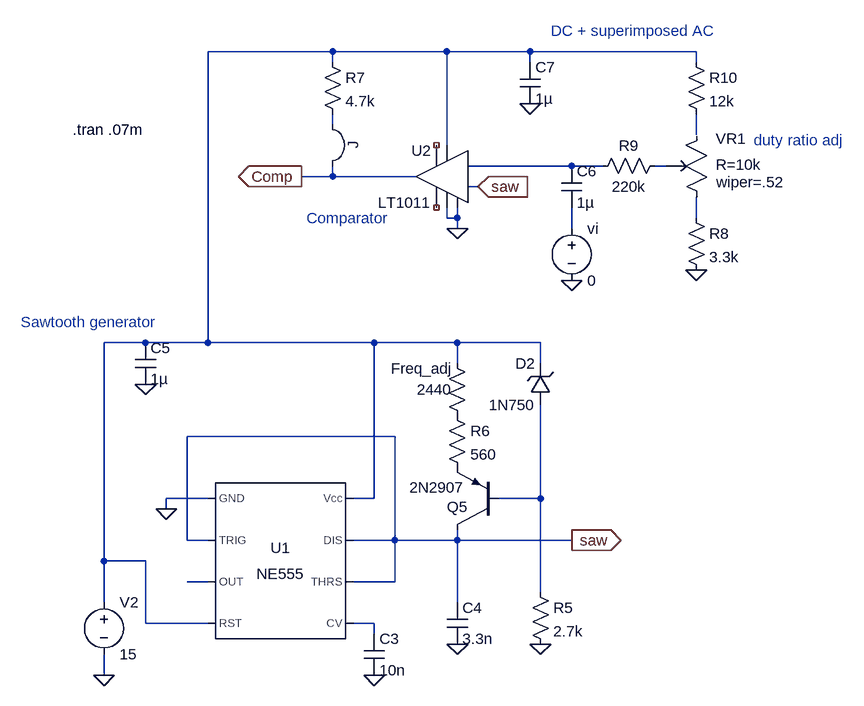
[diagram p0: schematic sawtooth_comp_dcac.asc]
sawtooth_comp_dcac.asc, the LTspice schematic file:
Version 4
SHEET 1 1036 680
WIRE 112 -592 -80 -592
WIRE 288 -592 112 -592
WIRE 416 -592 288 -592
WIRE 672 -592 416 -592
WIRE 112 -576 112 -592
WIRE 416 -576 416 -592
WIRE 672 -576 672 -592
WIRE 112 -480 112 -496
WIRE 672 -464 672 -496
WIRE 288 -448 288 -592
WIRE 480 -416 320 -416
WIRE 528 -416 480 -416
WIRE 624 -416 608 -416
WIRE 112 -400 112 -416
WIRE 112 -400 64 -400
WIRE 240 -400 112 -400
WIRE 336 -384 320 -384
WIRE 288 -336 288 -352
WIRE 304 -336 304 -352
WIRE 304 -336 288 -336
WIRE 672 -336 672 -368
WIRE 304 -320 304 -336
WIRE 480 -320 480 -352
WIRE -176 -144 -240 -144
WIRE -80 -144 -80 -592
WIRE -80 -144 -176 -144
WIRE 176 -144 -80 -144
WIRE 304 -144 176 -144
WIRE 432 -144 304 -144
WIRE 304 -112 304 -144
WIRE 432 -112 432 -144
WIRE 208 0 -112 0
WIRE -80 96 -144 96
WIRE 176 96 176 -144
WIRE 176 96 144 96
WIRE 432 96 432 -48
WIRE 432 96 368 96
WIRE -144 112 -144 96
WIRE -112 160 -112 0
WIRE -80 160 -112 160
WIRE 208 160 208 0
WIRE 208 160 144 160
WIRE 304 160 304 144
WIRE 304 160 208 160
WIRE 480 160 304 160
WIRE -240 192 -240 -144
WIRE -176 192 -240 192
WIRE -80 224 -112 224
WIRE 208 224 208 160
WIRE 208 224 144 224
WIRE 432 240 432 96
WIRE -240 256 -240 192
WIRE 304 256 304 160
WIRE -176 288 -176 192
WIRE -80 288 -176 288
WIRE 176 288 144 288
WIRE 176 304 176 288
WIRE -240 368 -240 336
FLAG -240 368 0
FLAG -144 112 0
FLAG 176 368 0
FLAG 304 320 0
FLAG -176 -80 0
FLAG 432 320 0
FLAG 480 160 saw
IOPIN 480 160 Out
FLAG 304 -320 0
FLAG 336 -384 saw
IOPIN 336 -384 In
FLAG 416 -512 0
FLAG 480 -240 0
FLAG 672 -256 0
FLAG 64 -400 Comp
IOPIN 64 -400 Out
SYMBOL Misc\\NE555 32 192 R0
SYMATTR InstName U1
SYMBOL voltage -240 240 R0
WINDOW 123 0 0 Left 0
WINDOW 39 0 0 Left 0
SYMATTR InstName V2
SYMATTR Value 15
SYMBOL res 288 -48 R0
SYMATTR InstName R6
SYMATTR Value 560
SYMBOL pnp 368 144 R180
WINDOW 0 48 35 Left 2
WINDOW 3 53 65 Left 2
SYMATTR InstName Q5
SYMATTR Value 2N2907
SYMBOL zener 448 -48 R180
WINDOW 0 24 64 Left 2
WINDOW 3 24 0 Left 2
SYMATTR InstName D2
SYMATTR Value 1N750
SYMBOL cap 160 304 R0
SYMATTR InstName C3
SYMATTR Value 10n
SYMBOL res 416 224 R0
SYMATTR InstName R5
SYMATTR Value 2.7k
SYMBOL cap 288 256 R0
SYMATTR InstName C4
SYMATTR Value 3.3n
SYMBOL cap -192 -144 R0
SYMATTR InstName C5
SYMATTR Value 1µ
SYMBOL res 288 -128 R0
WINDOW 0 -86 24 Left 2
WINDOW 3 -46 56 Left 2
SYMATTR InstName Freq_adj
SYMATTR Value 2440
SYMBOL Comparators\\LT1011 288 -400 M0
SYMATTR InstName U2
SYMBOL res 96 -592 R0
SYMATTR InstName R7
SYMATTR Value 4.7k
SYMBOL Misc\\jumper 176 -448 R90
SYMATTR InstName J
SYMBOL cap 400 -576 R0
SYMATTR InstName C7
SYMATTR Value 1µ
SYMBOL cap 464 -416 R0
SYMATTR InstName C6
SYMATTR Value 1µ
SYMBOL res 624 -432 R90
WINDOW 0 0 56 VBottom 2
WINDOW 3 32 56 VTop 2
SYMATTR InstName R9
SYMATTR Value 220k
SYMBOL potentiometer 672 -368 R0
SYMATTR InstName VR1
SYMATTR SpiceLine R=10k
SYMATTR SpiceLine2 wiper=.52
SYMBOL res 656 -592 R0
SYMATTR InstName R10
SYMATTR Value 12k
SYMBOL res 656 -352 R0
SYMATTR InstName R8
SYMATTR Value 3.3k
SYMBOL voltage 480 -336 R0
WINDOW 123 0 0 Left 0
WINDOW 39 0 0 Left 0
SYMATTR InstName vi
SYMATTR Value 0
TEXT -368 -176 Left 2 ;Sawtooth generator
TEXT -288 -472 Left 2 !.tran .07m
TEXT 72 -336 Left 2 ;Comparator
TEXT 448 -624 Left 2 ;DC + superimposed AC
TEXT 760 -456 Left 2 ;duty ratio adj

The netlist it stands for:
* sawtooth_comp_dcac.asc
XU1 0 saw N008 N001 N009 saw saw N001 NE555  ; pins GND TRIG OUT RST CV THRS DIS Vcc
V2 N001 0 15
R6 P001 P002 560
Q5 saw N007 P002 0 2N2907
D2 N007 N001 1N750
C3 N009 0 10n
R5 N007 0 2.7k
C4 saw 0 3.3n
C5 N001 0 1µ
R§Freq_adj N001 P001 2440
XU2 0 saw N003 0 NC_01 NC_02 Comp N001 LT1011
R7 N001 Comp 4.7k
C7 N001 0 1µ
C6 N003 N006 1µ
R9 N004 N003 220k
XVR1 N002 N005 N004 potentiometer R=10k wiper=.52  ; pins 1 2 3
R10 N001 N002 12k
R8 N005 0 3.3k
vi N006 0 0
.model D D
.lib standard.dio
.model NPN NPN
.model PNP PNP
.lib standard.bjt
* Sawtooth generator
.tran .07m
* Comparator
* DC + superimposed AC
* duty ratio adj
.lib NE555.sub
.lib LTC1.lib
.lib potentiometer.lib
.backanno
.end